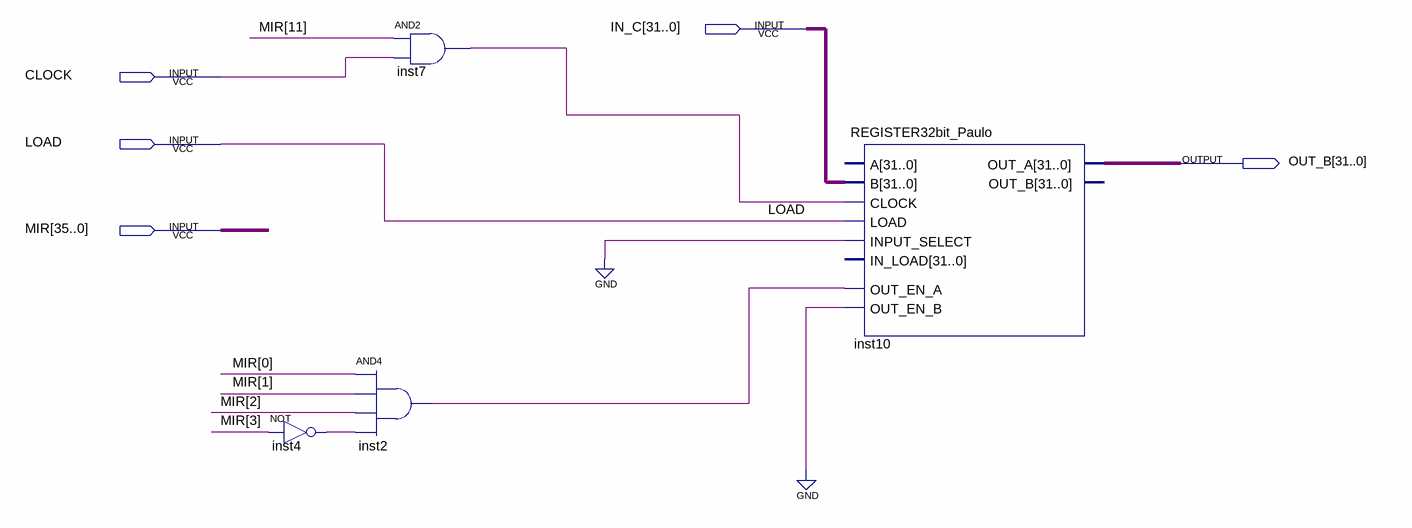
[diagram p0: schematic sheet]
// Quartus schematic TOS.bdf as structural Verilog: 4 symbols, 5 pins
module TOS (
  input  [31:0] IN_C,
  input  CLOCK,
  input  LOAD,
  input  [35:0] MIR,
  output [31:0] OUT_B
);

  wire inst2_out, inst4_out, inst7_out;

  not inst4 (inst4_out, MIR[3]);
  and inst7 (inst7_out, MIR[11], CLOCK);
  and inst2 (inst2_out, MIR[0], MIR[1], MIR[2], inst4_out);
  REGISTER32bit_Paulo inst10 (
    .B(IN_C), .OUT_EN_A(inst2_out), .INPUT_SELECT(1'b0), .LOAD(LOAD), .OUT_EN_B(1'b0), .CLOCK(inst7_out),
    .OUT_A(OUT_B));  // open: A, IN_LOAD, OUT_B
endmodule
